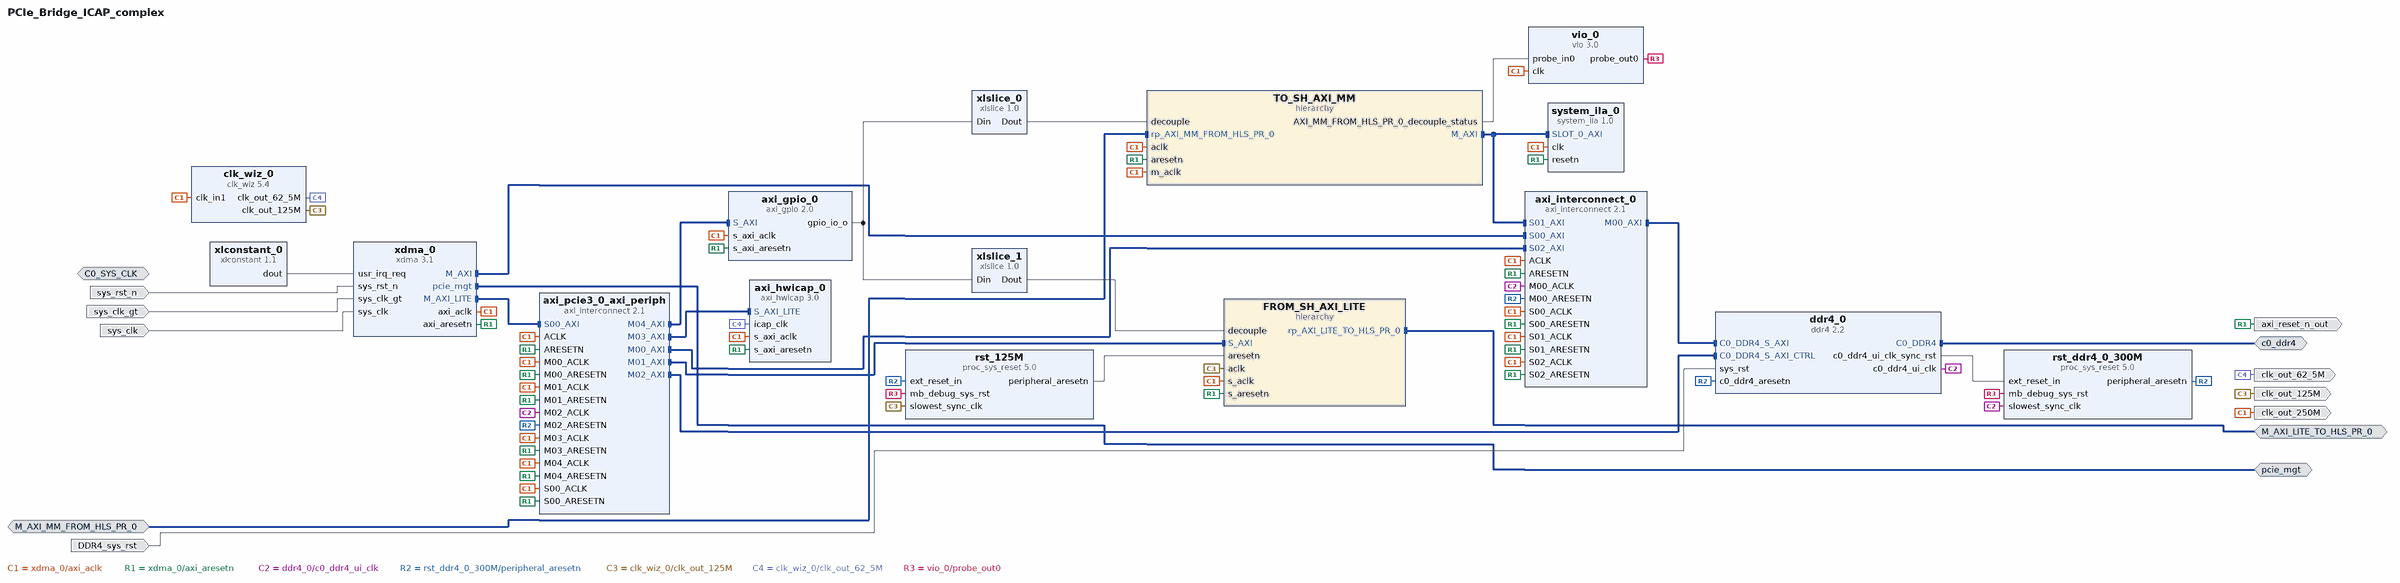
[diagram p0: block diagram of the top level]
# Vivado block design PCIe_Bridge_ICAP_complex, xcku115-flvb2104-2-i, Vivado 2017.1_sdx
create_bd_design PCIe_Bridge_ICAP_complex

create_bd_intf_port -mode Master -vlnv xilinx.com:interface:pcie_7x_mgt_rtl:1.0 pcie_mgt
create_bd_intf_port -mode Master -vlnv xilinx.com:interface:ddr4_rtl:1.0 c0_ddr4
create_bd_intf_port -mode Slave -vlnv xilinx.com:interface:aximm_rtl:1.0 M_AXI_MM_FROM_HLS_PR_0
set_property -dict [list \
  CONFIG.DATA_WIDTH 512 \
  CONFIG.PROTOCOL AXI4 \
  CONFIG.ID_WIDTH 0 \
  CONFIG.ADDR_WIDTH 32 \
  CONFIG.AWUSER_WIDTH 0 \
  CONFIG.ARUSER_WIDTH 0 \
  CONFIG.WUSER_WIDTH 0 \
  CONFIG.RUSER_WIDTH 0 \
  CONFIG.BUSER_WIDTH 0 \
  CONFIG.READ_WRITE_MODE READ_WRITE \
  CONFIG.HAS_BURST 1 \
  CONFIG.HAS_LOCK 1 \
  CONFIG.HAS_PROT 1 \
  CONFIG.HAS_CACHE 1 \
  CONFIG.HAS_QOS 1 \
  CONFIG.HAS_REGION 1 \
  CONFIG.HAS_WSTRB 1 \
  CONFIG.HAS_BRESP 1 \
  CONFIG.HAS_RRESP 1 \
  CONFIG.SUPPORTS_NARROW_BURST 1 \
  CONFIG.NUM_READ_OUTSTANDING 32 \
  CONFIG.NUM_WRITE_OUTSTANDING 32 \
  CONFIG.MAX_BURST_LENGTH 256 \
  CONFIG.NUM_READ_THREADS 1 \
  CONFIG.NUM_WRITE_THREADS 1 \
  CONFIG.RUSER_BITS_PER_BYTE 0 \
  CONFIG.WUSER_BITS_PER_BYTE 0 \
] [get_bd_intf_ports M_AXI_MM_FROM_HLS_PR_0]
create_bd_intf_port -mode Master -vlnv xilinx.com:interface:aximm_rtl:1.0 M_AXI_LITE_TO_HLS_PR_0
set_property -dict [list \
  CONFIG.DATA_WIDTH 32 \
  CONFIG.PROTOCOL AXI4LITE \
  CONFIG.FREQ_HZ 125000000 \
  CONFIG.ADDR_WIDTH 32 \
  CONFIG.HAS_BURST 0 \
  CONFIG.HAS_QOS 0 \
  CONFIG.HAS_REGION 0 \
] [get_bd_intf_ports M_AXI_LITE_TO_HLS_PR_0]
create_bd_intf_port -mode Slave -vlnv xilinx.com:interface:diff_clock_rtl:1.0 C0_SYS_CLK
set_property -dict {CONFIG.FREQ_HZ 300000000} [get_bd_intf_ports C0_SYS_CLK]
create_bd_port -dir O -type clk clk_out_250M
set_property -dict {CONFIG.ASSOCIATED_BUSIF M_AXI_MM_FROM_HLS_PR_0} [get_bd_ports clk_out_250M]
create_bd_port -dir O -type rst axi_reset_n_out
create_bd_port -dir I -type rst DDR4_sys_rst
set_property -dict {CONFIG.POLARITY ACTIVE_HIGH} [get_bd_ports DDR4_sys_rst]
create_bd_port -dir I -type rst sys_rst_n
create_bd_port -dir I -type clk sys_clk_gt
create_bd_port -dir I -type clk sys_clk
create_bd_port -dir O -type clk clk_out_125M
set_property -dict {CONFIG.FREQ_HZ 125000000 CONFIG.ASSOCIATED_BUSIF M_AXI_LITE_TO_HLS_PR_0} [get_bd_ports clk_out_125M]
create_bd_port -dir O -type clk clk_out_62_5M
set_property -dict {CONFIG.FREQ_HZ 62500000} [get_bd_ports clk_out_62_5M]

create_bd_cell -type ip -vlnv xilinx.com:ip:xlconstant:1.1 xlconstant_0
set_property -dict {CONFIG.CONST_VAL 0} [get_bd_cells xlconstant_0]
create_bd_cell -type ip -vlnv xilinx.com:ip:axi_interconnect:2.1 axi_pcie3_0_axi_periph
set_property -dict [list \
  CONFIG.NUM_MI 5 \
  CONFIG.M00_HAS_REGSLICE 4 \
  CONFIG.M01_HAS_REGSLICE 4 \
  CONFIG.M02_HAS_REGSLICE 4 \
  CONFIG.S00_HAS_REGSLICE 4 \
] [get_bd_cells axi_pcie3_0_axi_periph]
create_bd_cell -type ip -vlnv xilinx.com:ip:axi_interconnect:2.1 axi_interconnect_0
set_property -dict [list \
  CONFIG.NUM_SI 3 \
  CONFIG.NUM_MI 1 \
  CONFIG.M00_HAS_REGSLICE 4 \
  CONFIG.M00_HAS_DATA_FIFO 0 \
  CONFIG.S00_HAS_REGSLICE 4 \
  CONFIG.S01_HAS_REGSLICE 4 \
  CONFIG.S02_HAS_REGSLICE 4 \
  CONFIG.S00_HAS_DATA_FIFO 1 \
  CONFIG.S01_HAS_DATA_FIFO 1 \
  CONFIG.S02_HAS_DATA_FIFO 1 \
] [get_bd_cells axi_interconnect_0]
create_bd_cell -type ip -vlnv xilinx.com:ip:ddr4:2.2 ddr4_0
set_property -dict [list \
  CONFIG.C0.DDR4_TimePeriod 1110 \
  CONFIG.C0.DDR4_InputClockPeriod 3330 \
  CONFIG.C0.DDR4_MemoryPart EDY4016AABG-DR-F \
  CONFIG.C0.DDR4_DataWidth 72 \
  CONFIG.C0.DDR4_DataMask NO_DM_NO_DBI \
  CONFIG.C0.DDR4_CasLatency 13 \
  CONFIG.C0.DDR4_CasWriteLatency 12 \
  CONFIG.C0.DDR4_AxiDataWidth 512 \
  CONFIG.C0.DDR4_AxiAddressWidth 31 \
  CONFIG.C0.BANK_GROUP_WIDTH 1 \
] [get_bd_cells ddr4_0]
create_bd_cell -type ip -vlnv xilinx.com:ip:proc_sys_reset:5.0 rst_ddr4_0_300M
create_bd_cell -type ip -vlnv xilinx.com:ip:xdma:3.1 xdma_0
set_property -dict [list \
  CONFIG.mode_selection Advanced \
  CONFIG.pl_link_cap_max_link_width X8 \
  CONFIG.pl_link_cap_max_link_speed 8.0_GT/s \
  CONFIG.axi_data_width 256_bit \
  CONFIG.axisten_freq 250 \
  CONFIG.pipe_sim true \
  CONFIG.pf0_device_id 8038 \
  CONFIG.axilite_master_en true \
  CONFIG.axilite_master_size 512 \
  CONFIG.axilite_master_scale Megabytes \
  CONFIG.cfg_mgmt_if false \
] [get_bd_cells xdma_0]
create_bd_cell -type ip -vlnv xilinx.com:ip:clk_wiz:5.4 clk_wiz_0
set_property -dict [list \
  CONFIG.USE_FREQ_SYNTH true \
  CONFIG.USE_PHASE_ALIGNMENT false \
  CONFIG.JITTER_SEL Min_O_Jitter \
  CONFIG.SECONDARY_SOURCE Single_ended_clock_capable_pin \
  CONFIG.CLKOUT2_USED true \
  CONFIG.NUM_OUT_CLKS 2 \
  CONFIG.CLK_OUT1_PORT clk_out_125M \
  CONFIG.CLK_OUT2_PORT clk_out_62_5M \
  CONFIG.CLKOUT1_REQUESTED_OUT_FREQ 125.000 \
  CONFIG.CLKOUT2_REQUESTED_OUT_FREQ 62.5 \
  CONFIG.PRIM_SOURCE No_buffer \
  CONFIG.CLKOUT1_DRIVES Buffer \
  CONFIG.CLKOUT2_DRIVES Buffer \
  CONFIG.CLKOUT3_DRIVES Buffer \
  CONFIG.CLKOUT4_DRIVES Buffer \
  CONFIG.CLKOUT5_DRIVES Buffer \
  CONFIG.CLKOUT6_DRIVES Buffer \
  CONFIG.CLKOUT7_DRIVES Buffer \
  CONFIG.USE_LOCKED false \
  CONFIG.USE_RESET false \
  CONFIG.MMCM_DIVCLK_DIVIDE 1 \
  CONFIG.MMCM_BANDWIDTH HIGH \
  CONFIG.MMCM_CLKFBOUT_MULT_F 5.750 \
  CONFIG.MMCM_CLKOUT0_DIVIDE_F 11.500 \
  CONFIG.MMCM_CLKOUT1_DIVIDE 23 \
  CONFIG.CLKOUT1_JITTER 92.747 \
  CONFIG.CLKOUT1_PHASE_ERROR 73.217 \
  CONFIG.CLKOUT2_JITTER 106.166 \
  CONFIG.CLKOUT2_PHASE_ERROR 73.217 \
] [get_bd_cells clk_wiz_0]
create_bd_cell -type ip -vlnv xilinx.com:ip:proc_sys_reset:5.0 rst_125M
create_bd_cell -type ip -vlnv xilinx.com:ip:axi_hwicap:3.0 axi_hwicap_0
create_bd_cell -type hier TO_SH_AXI_MM
create_bd_cell -type hier FROM_SH_AXI_LITE
create_bd_cell -type ip -vlnv xilinx.com:ip:axi_gpio:2.0 axi_gpio_0
set_property -dict {CONFIG.C_ALL_OUTPUTS 1} [get_bd_cells axi_gpio_0]
create_bd_cell -type ip -vlnv xilinx.com:ip:xlslice:1.0 xlslice_0
set_property -dict {CONFIG.DIN_TO 0 CONFIG.DIN_FROM 0 CONFIG.DOUT_WIDTH 1} [get_bd_cells xlslice_0]
create_bd_cell -type ip -vlnv xilinx.com:ip:xlslice:1.0 xlslice_1
set_property -dict {CONFIG.DIN_TO 1 CONFIG.DIN_FROM 1 CONFIG.DOUT_WIDTH 1} [get_bd_cells xlslice_1]
create_bd_cell -type ip -vlnv xilinx.com:ip:vio:3.0 vio_0
create_bd_cell -type ip -vlnv xilinx.com:ip:system_ila:1.0 system_ila_0
set_property -dict [list \
  CONFIG.C_SLOT_0_MAX_RD_BURSTS 32 \
  CONFIG.C_SLOT_0_MAX_WR_BURSTS 32 \
  CONFIG.C_SLOT_0_TXN_CNTR_EN 0 \
  CONFIG.C_SLOT_0_AXI_W_SEL_TRIG 0 \
  CONFIG.C_SLOT_0_AXI_B_SEL_TRIG 0 \
  CONFIG.C_SLOT_0_AXI_R_SEL_TRIG 0 \
  CONFIG.C_INPUT_PIPE_STAGES 4 \
  CONFIG.ALL_PROBE_SAME_MU true \
] [get_bd_cells system_ila_0]

# ---- hierarchy /TO_SH_AXI_MM ----
current_bd_instance /TO_SH_AXI_MM
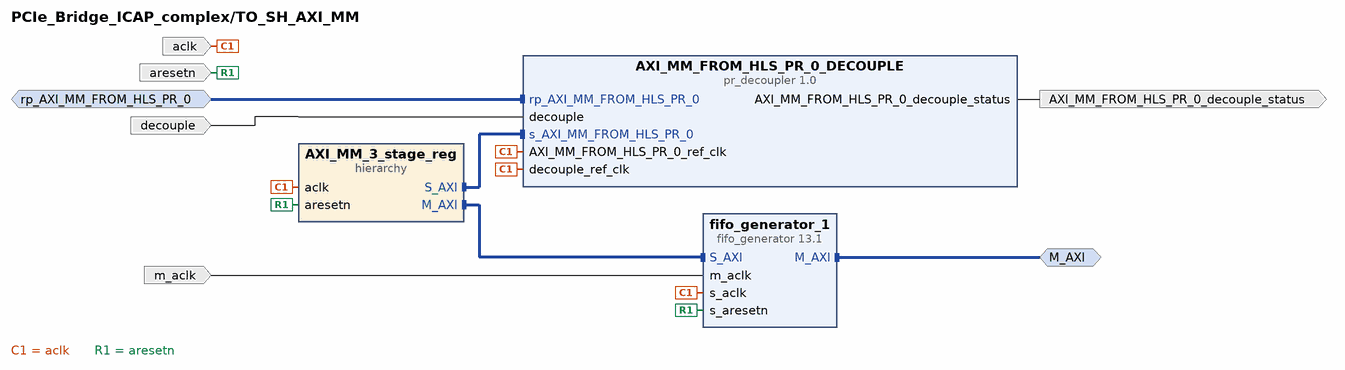
[diagram p1: block diagram inside /TO_SH_AXI_MM]
create_bd_intf_pin -mode Master -vlnv xilinx.com:interface:aximm_rtl:1.0 M_AXI
create_bd_intf_pin -mode Slave -vlnv xilinx.com:interface:aximm_rtl:1.0 rp_AXI_MM_FROM_HLS_PR_0
create_bd_pin -dir I -type clk m_aclk
create_bd_pin -dir I -type clk aclk
create_bd_pin -dir I -type rst aresetn
create_bd_pin -dir I decouple
create_bd_pin -dir O AXI_MM_FROM_HLS_PR_0_decouple_status

create_bd_cell -type ip -vlnv xilinx.com:ip:fifo_generator:13.1 fifo_generator_1
set_property -dict [list \
  CONFIG.INTERFACE_TYPE AXI_MEMORY_MAPPED \
  CONFIG.PROTOCOL AXI4 \
  CONFIG.Clock_Type_AXI Independent_Clock \
  CONFIG.FIFO_Implementation_wach Independent_Clocks_Distributed_RAM \
  CONFIG.FIFO_Implementation_wdch Independent_Clocks_Builtin_FIFO \
  CONFIG.FIFO_Implementation_wrch Independent_Clocks_Distributed_RAM \
  CONFIG.FIFO_Implementation_rach Independent_Clocks_Distributed_RAM \
  CONFIG.FIFO_Implementation_rdch Independent_Clocks_Builtin_FIFO \
  CONFIG.FIFO_Implementation_axis Independent_Clocks_Builtin_FIFO \
] [get_bd_cells fifo_generator_1]
create_bd_cell -type hier AXI_MM_3_stage_reg
create_bd_cell -type ip -vlnv xilinx.com:ip:pr_decoupler:1.0 AXI_MM_FROM_HLS_PR_0_DECOUPLE
set_property -dict [list \
  CONFIG.ALL_PARAMS {HAS_SIGNAL_CONTROL 1 HAS_SIGNAL_STATUS 0 INTF {AXI_MM_FROM_HLS_PR_0 {ID 0 VLNV xilinx.com:interface:aximm_rtl:1.0 CDC_STAGES 4 SIGNALS {ARVALID {PRESENT 1 WIDTH 1} ARREADY {PRESENT 1 WIDTH 1} AWVALID {PRESENT 1 WIDTH 1} AWREADY {PRESENT 1 WIDTH 1} BVALID {PRESENT 1 WIDTH 1} BREADY {PRESENT 1 WIDTH 1} RVALID {PRESENT 1 WIDTH 1} RREADY {PRESENT 1 WIDTH 1} WVALID {PRESENT 1 WIDTH 1} WREADY {PRESENT 1 WIDTH 1} AWID {PRESENT 0 WIDTH 0} AWADDR {PRESENT 1 WIDTH 32} AWLEN {PRESENT 1 WIDTH 8} AWSIZE {PRESENT 1 WIDTH 3} AWBURST {PRESENT 1 WIDTH 2} AWLOCK {PRESENT 1 WIDTH 1} AWCACHE {PRESENT 1 WIDTH 4} AWPROT {PRESENT 1 WIDTH 3} AWREGION {PRESENT 1 WIDTH 4} AWQOS {PRESENT 1 WIDTH 4} AWUSER {PRESENT 0 WIDTH 0} WID {PRESENT 0 WIDTH 0} WDATA {PRESENT 1 WIDTH 512} WSTRB {PRESENT 1 WIDTH 64} WLAST {PRESENT 1 WIDTH 1} WUSER {PRESENT 0 WIDTH 0} BID {PRESENT 0 WIDTH 0} BRESP {PRESENT 1 WIDTH 2} BUSER {PRESENT 0 WIDTH 0} ARID {PRESENT 0 WIDTH 0} ARADDR {PRESENT 1 WIDTH 32} ARLEN {PRESENT 1 WIDTH 8} ARSIZE {PRESENT 1 WIDTH 3} ARBURST {PRESENT 1 WIDTH 2} ARLOCK {PRESENT 1 WIDTH 1} ARCACHE {PRESENT 1 WIDTH 4} ARPROT {PRESENT 1 WIDTH 3} ARREGION {PRESENT 1 WIDTH 4} ARQOS {PRESENT 1 WIDTH 4} ARUSER {PRESENT 0 WIDTH 0} RID {PRESENT 0 WIDTH 0} RDATA {PRESENT 1 WIDTH 512} RRESP {PRESENT 1 WIDTH 2} RLAST {PRESENT 1 WIDTH 1} RUSER {PRESENT 0 WIDTH 0}}}} IPI_PROP_COUNT 0} \
  CONFIG.GUI_HAS_SIGNAL_CONTROL 1 \
  CONFIG.GUI_HAS_SIGNAL_STATUS false \
  CONFIG.GUI_SELECT_INTERFACE 0 \
  CONFIG.GUI_INTERFACE_NAME AXI_MM_FROM_HLS_PR_0 \
  CONFIG.GUI_SELECT_VLNV xilinx.com:interface:aximm_rtl:1.0 \
  CONFIG.GUI_INTERFACE_PROTOCOL axi4 \
  CONFIG.GUI_SELECT_CDC_STAGES 4 \
  CONFIG.GUI_SIGNAL_SELECT_0 ARVALID \
  CONFIG.GUI_SIGNAL_SELECT_1 ARREADY \
  CONFIG.GUI_SIGNAL_SELECT_2 AWVALID \
  CONFIG.GUI_SIGNAL_SELECT_3 AWREADY \
  CONFIG.GUI_SIGNAL_SELECT_4 BVALID \
  CONFIG.GUI_SIGNAL_SELECT_5 BREADY \
  CONFIG.GUI_SIGNAL_SELECT_6 RVALID \
  CONFIG.GUI_SIGNAL_SELECT_7 RREADY \
  CONFIG.GUI_SIGNAL_SELECT_8 WVALID \
  CONFIG.GUI_SIGNAL_SELECT_9 WREADY \
  CONFIG.GUI_SIGNAL_DECOUPLED_0 true \
  CONFIG.GUI_SIGNAL_DECOUPLED_1 true \
  CONFIG.GUI_SIGNAL_DECOUPLED_2 true \
  CONFIG.GUI_SIGNAL_DECOUPLED_3 true \
  CONFIG.GUI_SIGNAL_DECOUPLED_4 true \
  CONFIG.GUI_SIGNAL_DECOUPLED_5 true \
  CONFIG.GUI_SIGNAL_DECOUPLED_6 true \
  CONFIG.GUI_SIGNAL_DECOUPLED_7 true \
  CONFIG.GUI_SIGNAL_DECOUPLED_8 true \
  CONFIG.GUI_SIGNAL_DECOUPLED_9 true \
] [get_bd_cells AXI_MM_FROM_HLS_PR_0_DECOUPLE]

# ---- hierarchy /TO_SH_AXI_MM/AXI_MM_3_stage_reg ----
current_bd_instance /TO_SH_AXI_MM/AXI_MM_3_stage_reg
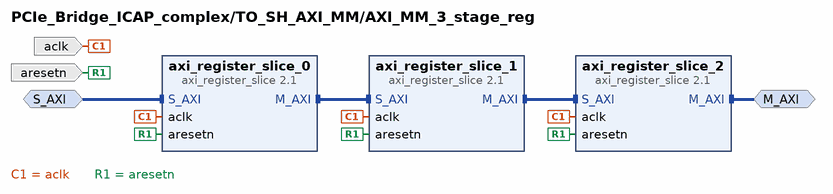
[diagram p2: block diagram inside /TO_SH_AXI_MM/AXI_MM_3_stage_reg]
create_bd_intf_pin -mode Slave -vlnv xilinx.com:interface:aximm_rtl:1.0 S_AXI
create_bd_intf_pin -mode Master -vlnv xilinx.com:interface:aximm_rtl:1.0 M_AXI
create_bd_pin -dir I -type clk aclk
create_bd_pin -dir I -type rst aresetn

create_bd_cell -type ip -vlnv xilinx.com:ip:axi_register_slice:2.1 axi_register_slice_0
create_bd_cell -type ip -vlnv xilinx.com:ip:axi_register_slice:2.1 axi_register_slice_1
create_bd_cell -type ip -vlnv xilinx.com:ip:axi_register_slice:2.1 axi_register_slice_2

# ---- hierarchy /FROM_SH_AXI_LITE ----
current_bd_instance /FROM_SH_AXI_LITE
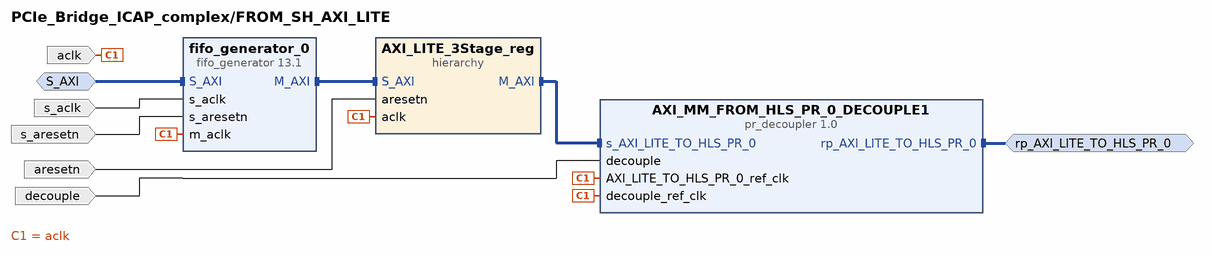
[diagram p3: block diagram inside /FROM_SH_AXI_LITE]
create_bd_intf_pin -mode Slave -vlnv xilinx.com:interface:aximm_rtl:1.0 S_AXI
create_bd_intf_pin -mode Master -vlnv xilinx.com:interface:aximm_rtl:1.0 rp_AXI_LITE_TO_HLS_PR_0
create_bd_pin -dir I -type clk aclk
create_bd_pin -dir I -type clk s_aclk
create_bd_pin -dir I -type rst s_aresetn
create_bd_pin -dir I -type rst aresetn
create_bd_pin -dir I decouple

create_bd_cell -type ip -vlnv xilinx.com:ip:fifo_generator:13.1 fifo_generator_0
set_property -dict [list \
  CONFIG.INTERFACE_TYPE AXI_MEMORY_MAPPED \
  CONFIG.PROTOCOL AXI4_Lite \
  CONFIG.Clock_Type_AXI Independent_Clock \
  CONFIG.FIFO_Implementation_wach Independent_Clocks_Distributed_RAM \
  CONFIG.FIFO_Implementation_wdch Independent_Clocks_Builtin_FIFO \
  CONFIG.FIFO_Implementation_wrch Independent_Clocks_Distributed_RAM \
  CONFIG.FIFO_Implementation_rach Independent_Clocks_Distributed_RAM \
  CONFIG.FIFO_Implementation_rdch Independent_Clocks_Builtin_FIFO \
  CONFIG.FIFO_Implementation_axis Independent_Clocks_Builtin_FIFO \
] [get_bd_cells fifo_generator_0]
create_bd_cell -type hier AXI_LITE_3Stage_reg
create_bd_cell -type ip -vlnv xilinx.com:ip:pr_decoupler:1.0 AXI_MM_FROM_HLS_PR_0_DECOUPLE1
set_property -dict [list \
  CONFIG.ALL_PARAMS {HAS_SIGNAL_CONTROL 1 HAS_SIGNAL_STATUS 0 INTF {AXI_LITE_TO_HLS_PR_0 {ID 0 VLNV xilinx.com:interface:aximm_rtl:1.0 CDC_STAGES 4 MODE slave PROTOCOL axi4lite SIGNALS {ARVALID {PRESENT 1 WIDTH 1} ARREADY {PRESENT 1 WIDTH 1} AWVALID {PRESENT 1 WIDTH 1} AWREADY {PRESENT 1 WIDTH 1} BVALID {PRESENT 1 WIDTH 1} BREADY {PRESENT 1 WIDTH 1} RVALID {PRESENT 1 WIDTH 1} RREADY {PRESENT 1 WIDTH 1} WVALID {PRESENT 1 WIDTH 1} WREADY {PRESENT 1 WIDTH 1} AWADDR {PRESENT 1 WIDTH 32} AWLEN {PRESENT 0 WIDTH 8} AWSIZE {PRESENT 0 WIDTH 3} AWBURST {PRESENT 0 WIDTH 2} AWLOCK {PRESENT 0 WIDTH 1} AWCACHE {PRESENT 0 WIDTH 4} AWPROT {PRESENT 1 WIDTH 3} WDATA {PRESENT 1 WIDTH 32} WSTRB {PRESENT 1 WIDTH 4} WLAST {PRESENT 0 WIDTH 1} BRESP {PRESENT 1 WIDTH 2} ARADDR {PRESENT 1 WIDTH 32} ARLEN {PRESENT 0 WIDTH 8} ARSIZE {PRESENT 0 WIDTH 3} ARBURST {PRESENT 0 WIDTH 2} ARLOCK {PRESENT 0 WIDTH 1} ARCACHE {PRESENT 0 WIDTH 4} ARPROT {PRESENT 1 WIDTH 3} RDATA {PRESENT 1 WIDTH 32} RRESP {PRESENT 1 WIDTH 2} RLAST {PRESENT 0 WIDTH 1} AWID {PRESENT 0 WIDTH 0} AWREGION {PRESENT 1 WIDTH 4} AWQOS {PRESENT 1 WIDTH 4} AWUSER {PRESENT 0 WIDTH 0} WID {PRESENT 0 WIDTH 0} WUSER {PRESENT 0 WIDTH 0} BID {PRESENT 0 WIDTH 0} BUSER {PRESENT 0 WIDTH 0} ARID {PRESENT 0 WIDTH 0} ARREGION {PRESENT 1 WIDTH 4} ARQOS {PRESENT 1 WIDTH 4} ARUSER {PRESENT 0 WIDTH 0} RID {PRESENT 0 WIDTH 0} RUSER {PRESENT 0 WIDTH 0}}}} IPI_PROP_COUNT 1} \
  CONFIG.GUI_HAS_SIGNAL_CONTROL 1 \
  CONFIG.GUI_HAS_SIGNAL_STATUS 0 \
  CONFIG.GUI_SELECT_INTERFACE 0 \
  CONFIG.GUI_INTERFACE_NAME AXI_LITE_TO_HLS_PR_0 \
  CONFIG.GUI_SELECT_VLNV xilinx.com:interface:aximm_rtl:1.0 \
  CONFIG.GUI_INTERFACE_PROTOCOL axi4lite \
  CONFIG.GUI_SELECT_MODE slave \
  CONFIG.GUI_SELECT_CDC_STAGES 4 \
  CONFIG.GUI_SIGNAL_SELECT_0 ARVALID \
  CONFIG.GUI_SIGNAL_SELECT_1 ARREADY \
  CONFIG.GUI_SIGNAL_SELECT_2 AWVALID \
  CONFIG.GUI_SIGNAL_SELECT_3 AWREADY \
  CONFIG.GUI_SIGNAL_SELECT_4 BVALID \
  CONFIG.GUI_SIGNAL_SELECT_5 BREADY \
  CONFIG.GUI_SIGNAL_SELECT_6 RVALID \
  CONFIG.GUI_SIGNAL_SELECT_7 RREADY \
  CONFIG.GUI_SIGNAL_SELECT_8 WVALID \
  CONFIG.GUI_SIGNAL_SELECT_9 WREADY \
  CONFIG.GUI_SIGNAL_DECOUPLED_0 true \
  CONFIG.GUI_SIGNAL_DECOUPLED_1 true \
  CONFIG.GUI_SIGNAL_DECOUPLED_2 true \
  CONFIG.GUI_SIGNAL_DECOUPLED_3 true \
  CONFIG.GUI_SIGNAL_DECOUPLED_4 true \
  CONFIG.GUI_SIGNAL_DECOUPLED_5 true \
  CONFIG.GUI_SIGNAL_DECOUPLED_6 true \
  CONFIG.GUI_SIGNAL_DECOUPLED_7 true \
  CONFIG.GUI_SIGNAL_DECOUPLED_8 true \
  CONFIG.GUI_SIGNAL_DECOUPLED_9 true \
] [get_bd_cells AXI_MM_FROM_HLS_PR_0_DECOUPLE1]

# ---- hierarchy /FROM_SH_AXI_LITE/AXI_LITE_3Stage_reg ----
current_bd_instance /FROM_SH_AXI_LITE/AXI_LITE_3Stage_reg
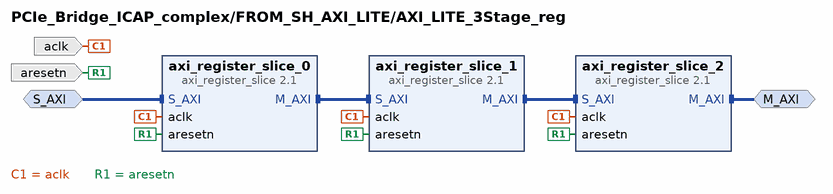
[diagram p4: block diagram inside /FROM_SH_AXI_LITE/AXI_LITE_3Stage_reg]
create_bd_intf_pin -mode Slave -vlnv xilinx.com:interface:aximm_rtl:1.0 S_AXI
create_bd_intf_pin -mode Master -vlnv xilinx.com:interface:aximm_rtl:1.0 M_AXI
create_bd_pin -dir I -type clk aclk
create_bd_pin -dir I -type rst aresetn

create_bd_cell -type ip -vlnv xilinx.com:ip:axi_register_slice:2.1 axi_register_slice_0
create_bd_cell -type ip -vlnv xilinx.com:ip:axi_register_slice:2.1 axi_register_slice_1
create_bd_cell -type ip -vlnv xilinx.com:ip:axi_register_slice:2.1 axi_register_slice_2

# ---- connections ----

current_bd_instance /TO_SH_AXI_MM
connect_bd_intf_net [get_bd_intf_pins AXI_MM_3_stage_reg/M_AXI] [get_bd_intf_pins fifo_generator_1/S_AXI]
connect_bd_intf_net [get_bd_intf_pins AXI_MM_3_stage_reg/S_AXI] [get_bd_intf_pins AXI_MM_FROM_HLS_PR_0_DECOUPLE/s_AXI_MM_FROM_HLS_PR_0]
connect_bd_intf_net [get_bd_intf_pins M_AXI] [get_bd_intf_pins fifo_generator_1/M_AXI]
connect_bd_intf_net [get_bd_intf_pins rp_AXI_MM_FROM_HLS_PR_0] [get_bd_intf_pins AXI_MM_FROM_HLS_PR_0_DECOUPLE/rp_AXI_MM_FROM_HLS_PR_0]
connect_bd_net -net axi_pcie3_0_axi_aclk [get_bd_pins m_aclk] [get_bd_pins fifo_generator_1/m_aclk]
connect_bd_net -net clk_wiz_0_clk_out_125M [get_bd_pins aclk] \
  [get_bd_pins fifo_generator_1/s_aclk] [get_bd_pins AXI_MM_FROM_HLS_PR_0_DECOUPLE/decouple_ref_clk] \
  [get_bd_pins AXI_MM_FROM_HLS_PR_0_DECOUPLE/AXI_MM_FROM_HLS_PR_0_ref_clk] [get_bd_pins AXI_MM_3_stage_reg/aclk]
connect_bd_net -net rst_ddr4_0_300M1_peripheral_aresetn [get_bd_pins aresetn] \
  [get_bd_pins fifo_generator_1/s_aresetn] [get_bd_pins AXI_MM_3_stage_reg/aresetn]
connect_bd_net [get_bd_pins decouple] [get_bd_pins AXI_MM_FROM_HLS_PR_0_DECOUPLE/decouple]
connect_bd_net [get_bd_pins AXI_MM_FROM_HLS_PR_0_DECOUPLE/AXI_MM_FROM_HLS_PR_0_decouple_status] [get_bd_pins AXI_MM_FROM_HLS_PR_0_decouple_status]

current_bd_instance /TO_SH_AXI_MM/AXI_MM_3_stage_reg
connect_bd_intf_net [get_bd_intf_pins axi_register_slice_1/S_AXI] [get_bd_intf_pins axi_register_slice_0/M_AXI]
connect_bd_intf_net [get_bd_intf_pins axi_register_slice_2/S_AXI] [get_bd_intf_pins axi_register_slice_1/M_AXI]
connect_bd_intf_net [get_bd_intf_pins S_AXI] [get_bd_intf_pins axi_register_slice_0/S_AXI]
connect_bd_intf_net [get_bd_intf_pins M_AXI] [get_bd_intf_pins axi_register_slice_2/M_AXI]
connect_bd_net -net axi_pcie3_0_axi_aclk [get_bd_pins aclk] \
  [get_bd_pins axi_register_slice_2/aclk] [get_bd_pins axi_register_slice_1/aclk] [get_bd_pins axi_register_slice_0/aclk]
connect_bd_net -net axi_pcie3_0_axi_aresetn [get_bd_pins aresetn] \
  [get_bd_pins axi_register_slice_2/aresetn] [get_bd_pins axi_register_slice_1/aresetn] \
  [get_bd_pins axi_register_slice_0/aresetn]

current_bd_instance /FROM_SH_AXI_LITE
connect_bd_intf_net [get_bd_intf_pins fifo_generator_0/M_AXI] [get_bd_intf_pins AXI_LITE_3Stage_reg/S_AXI]
connect_bd_intf_net [get_bd_intf_pins AXI_LITE_3Stage_reg/M_AXI] [get_bd_intf_pins AXI_MM_FROM_HLS_PR_0_DECOUPLE1/s_AXI_LITE_TO_HLS_PR_0]
connect_bd_intf_net [get_bd_intf_pins S_AXI] [get_bd_intf_pins fifo_generator_0/S_AXI]
connect_bd_intf_net [get_bd_intf_pins rp_AXI_LITE_TO_HLS_PR_0] [get_bd_intf_pins AXI_MM_FROM_HLS_PR_0_DECOUPLE1/rp_AXI_LITE_TO_HLS_PR_0]
connect_bd_net -net clk_wiz_0_clk_out_125M [get_bd_pins aclk] \
  [get_bd_pins fifo_generator_0/m_aclk] [get_bd_pins AXI_MM_FROM_HLS_PR_0_DECOUPLE1/AXI_LITE_TO_HLS_PR_0_ref_clk] \
  [get_bd_pins AXI_MM_FROM_HLS_PR_0_DECOUPLE1/decouple_ref_clk] [get_bd_pins AXI_LITE_3Stage_reg/aclk]
connect_bd_net -net axi_pcie3_0_axi_aclk [get_bd_pins s_aclk] [get_bd_pins fifo_generator_0/s_aclk]
connect_bd_net -net axi_pcie3_0_axi_aresetn [get_bd_pins s_aresetn] [get_bd_pins fifo_generator_0/s_aresetn]
connect_bd_net -net rst_ddr4_0_300M1_peripheral_aresetn [get_bd_pins aresetn] [get_bd_pins AXI_LITE_3Stage_reg/aresetn]
connect_bd_net [get_bd_pins decouple] [get_bd_pins AXI_MM_FROM_HLS_PR_0_DECOUPLE1/decouple]

current_bd_instance /FROM_SH_AXI_LITE/AXI_LITE_3Stage_reg
connect_bd_intf_net [get_bd_intf_pins axi_register_slice_1/M_AXI] [get_bd_intf_pins axi_register_slice_2/S_AXI]
connect_bd_intf_net [get_bd_intf_pins axi_register_slice_1/S_AXI] [get_bd_intf_pins axi_register_slice_0/M_AXI]
connect_bd_intf_net [get_bd_intf_pins S_AXI] [get_bd_intf_pins axi_register_slice_0/S_AXI]
connect_bd_intf_net [get_bd_intf_pins M_AXI] [get_bd_intf_pins axi_register_slice_2/M_AXI]
connect_bd_net [get_bd_pins aclk] \
  [get_bd_pins axi_register_slice_0/aclk] [get_bd_pins axi_register_slice_1/aclk] [get_bd_pins axi_register_slice_2/aclk]
connect_bd_net [get_bd_pins aresetn] \
  [get_bd_pins axi_register_slice_0/aresetn] [get_bd_pins axi_register_slice_1/aresetn] \
  [get_bd_pins axi_register_slice_2/aresetn]

current_bd_instance /
connect_bd_intf_net [get_bd_intf_pins axi_pcie3_0_axi_periph/M02_AXI] [get_bd_intf_pins ddr4_0/C0_DDR4_S_AXI_CTRL]
connect_bd_intf_net [get_bd_intf_pins axi_pcie3_0_axi_periph/S00_AXI] [get_bd_intf_pins xdma_0/M_AXI_LITE]
connect_bd_intf_net [get_bd_intf_pins axi_interconnect_0/M00_AXI] [get_bd_intf_pins ddr4_0/C0_DDR4_S_AXI]
connect_bd_intf_net [get_bd_intf_pins axi_interconnect_0/S00_AXI] [get_bd_intf_pins xdma_0/M_AXI]
connect_bd_intf_net [get_bd_intf_pins axi_interconnect_0/S02_AXI] [get_bd_intf_pins axi_pcie3_0_axi_periph/M00_AXI]
connect_bd_intf_net [get_bd_intf_pins FROM_SH_AXI_LITE/S_AXI] [get_bd_intf_pins axi_pcie3_0_axi_periph/M01_AXI]
connect_bd_intf_net [get_bd_intf_pins TO_SH_AXI_MM/M_AXI] [get_bd_intf_pins axi_interconnect_0/S01_AXI]
connect_bd_intf_net [get_bd_intf_pins TO_SH_AXI_MM/M_AXI] [get_bd_intf_pins system_ila_0/SLOT_0_AXI]
connect_bd_intf_net [get_bd_intf_pins axi_hwicap_0/S_AXI_LITE] [get_bd_intf_pins axi_pcie3_0_axi_periph/M03_AXI]
connect_bd_intf_net [get_bd_intf_pins axi_gpio_0/S_AXI] [get_bd_intf_pins axi_pcie3_0_axi_periph/M04_AXI]
connect_bd_intf_net [get_bd_intf_ports pcie_mgt] [get_bd_intf_pins xdma_0/pcie_mgt]
connect_bd_intf_net [get_bd_intf_ports c0_ddr4] [get_bd_intf_pins ddr4_0/C0_DDR4]
connect_bd_intf_net [get_bd_intf_ports M_AXI_MM_FROM_HLS_PR_0] [get_bd_intf_pins TO_SH_AXI_MM/rp_AXI_MM_FROM_HLS_PR_0]
connect_bd_intf_net [get_bd_intf_ports M_AXI_LITE_TO_HLS_PR_0] [get_bd_intf_pins FROM_SH_AXI_LITE/rp_AXI_LITE_TO_HLS_PR_0]
connect_bd_net -net axi_pcie3_0_axi_aclk [get_bd_pins xdma_0/axi_aclk] \
  [get_bd_ports clk_out_250M] [get_bd_pins clk_wiz_0/clk_in1] [get_bd_pins axi_hwicap_0/s_axi_aclk] \
  [get_bd_pins axi_gpio_0/s_axi_aclk] [get_bd_pins vio_0/clk] [get_bd_pins system_ila_0/clk] \
  [get_bd_pins axi_pcie3_0_axi_periph/S00_ACLK] [get_bd_pins axi_pcie3_0_axi_periph/M00_ACLK] \
  [get_bd_pins axi_pcie3_0_axi_periph/ACLK] [get_bd_pins axi_interconnect_0/ACLK] [get_bd_pins axi_interconnect_0/S00_ACLK] \
  [get_bd_pins axi_interconnect_0/S02_ACLK] [get_bd_pins axi_pcie3_0_axi_periph/M01_ACLK] \
  [get_bd_pins axi_interconnect_0/S01_ACLK] [get_bd_pins axi_pcie3_0_axi_periph/M03_ACLK] [get_bd_pins TO_SH_AXI_MM/m_aclk] \
  [get_bd_pins FROM_SH_AXI_LITE/s_aclk] [get_bd_pins axi_pcie3_0_axi_periph/M04_ACLK] [get_bd_pins TO_SH_AXI_MM/aclk]
connect_bd_net -net axi_pcie3_0_axi_aresetn [get_bd_pins xdma_0/axi_aresetn] \
  [get_bd_ports axi_reset_n_out] [get_bd_pins axi_hwicap_0/s_axi_aresetn] [get_bd_pins axi_gpio_0/s_axi_aresetn] \
  [get_bd_pins system_ila_0/resetn] [get_bd_pins axi_pcie3_0_axi_periph/S00_ARESETN] \
  [get_bd_pins axi_pcie3_0_axi_periph/M00_ARESETN] [get_bd_pins axi_pcie3_0_axi_periph/ARESETN] \
  [get_bd_pins axi_interconnect_0/ARESETN] [get_bd_pins axi_interconnect_0/S00_ARESETN] \
  [get_bd_pins axi_interconnect_0/S02_ARESETN] [get_bd_pins axi_pcie3_0_axi_periph/M01_ARESETN] \
  [get_bd_pins axi_interconnect_0/S01_ARESETN] [get_bd_pins axi_pcie3_0_axi_periph/M03_ARESETN] \
  [get_bd_pins FROM_SH_AXI_LITE/s_aresetn] [get_bd_pins axi_pcie3_0_axi_periph/M04_ARESETN] \
  [get_bd_pins TO_SH_AXI_MM/aresetn]
connect_bd_net [get_bd_pins ddr4_0/c0_ddr4_ui_clk] \
  [get_bd_pins rst_ddr4_0_300M/slowest_sync_clk] [get_bd_pins axi_pcie3_0_axi_periph/M02_ACLK] \
  [get_bd_pins axi_interconnect_0/M00_ACLK]
connect_bd_net [get_bd_pins ddr4_0/c0_ddr4_ui_clk_sync_rst] [get_bd_pins rst_ddr4_0_300M/ext_reset_in]
connect_bd_net [get_bd_pins rst_ddr4_0_300M/peripheral_aresetn] \
  [get_bd_pins ddr4_0/c0_ddr4_aresetn] [get_bd_pins rst_125M/ext_reset_in] [get_bd_pins axi_pcie3_0_axi_periph/M02_ARESETN] \
  [get_bd_pins axi_interconnect_0/M00_ARESETN]
connect_bd_net -net sys_rst_1 [get_bd_ports DDR4_sys_rst] [get_bd_pins ddr4_0/sys_rst]
connect_bd_net [get_bd_pins xlconstant_0/dout] [get_bd_pins xdma_0/usr_irq_req]
connect_bd_net [get_bd_ports sys_rst_n] [get_bd_pins xdma_0/sys_rst_n]
connect_bd_net [get_bd_ports sys_clk_gt] [get_bd_pins xdma_0/sys_clk_gt]
connect_bd_net [get_bd_ports sys_clk] [get_bd_pins xdma_0/sys_clk]
connect_bd_net [get_bd_pins clk_wiz_0/clk_out_125M] \
  [get_bd_ports clk_out_125M] [get_bd_pins rst_125M/slowest_sync_clk] [get_bd_pins FROM_SH_AXI_LITE/aclk]
connect_bd_net [get_bd_pins clk_wiz_0/clk_out_62_5M] [get_bd_ports clk_out_62_5M] [get_bd_pins axi_hwicap_0/icap_clk]
connect_bd_net -net rst_ddr4_0_300M1_peripheral_aresetn [get_bd_pins rst_125M/peripheral_aresetn] [get_bd_pins FROM_SH_AXI_LITE/aresetn]
connect_bd_net [get_bd_pins axi_gpio_0/gpio_io_o] [get_bd_pins xlslice_0/Din] [get_bd_pins xlslice_1/Din]
connect_bd_net [get_bd_pins xlslice_0/Dout] [get_bd_pins TO_SH_AXI_MM/decouple]
connect_bd_net [get_bd_pins xlslice_1/Dout] [get_bd_pins FROM_SH_AXI_LITE/decouple]
connect_bd_net [get_bd_pins vio_0/probe_out0] [get_bd_pins rst_ddr4_0_300M/mb_debug_sys_rst] [get_bd_pins rst_125M/mb_debug_sys_rst]
connect_bd_net [get_bd_pins TO_SH_AXI_MM/AXI_MM_FROM_HLS_PR_0_decouple_status] [get_bd_pins vio_0/probe_in0]

# ---- address map ----
assign_bd_address -offset 0x00000000 -range 2G -target_address_space [get_bd_addr_spaces M_AXI_MM_FROM_HLS_PR_0] [get_bd_addr_segs ddr4_0/C0_DDR4_MEMORY_MAP/C0_DDR4_ADDRESS_BLOCK]
assign_bd_address -offset 0x0000000000000000 -range 2G -target_address_space [get_bd_addr_spaces xdma_0/M_AXI] [get_bd_addr_segs ddr4_0/C0_DDR4_MEMORY_MAP/C0_DDR4_ADDRESS_BLOCK]
assign_bd_address -offset 0x00000000 -range 256M -target_address_space [get_bd_addr_spaces xdma_0/M_AXI_LITE] [get_bd_addr_segs ddr4_0/C0_DDR4_MEMORY_MAP/C0_DDR4_ADDRESS_BLOCK]
assign_bd_address -offset 0x10000000 -range 64K -target_address_space [get_bd_addr_spaces xdma_0/M_AXI_LITE] [get_bd_addr_segs axi_hwicap_0/S_AXI_LITE/Reg]
assign_bd_address -offset 0x10010000 -range 64K -target_address_space [get_bd_addr_spaces xdma_0/M_AXI_LITE] [get_bd_addr_segs M_AXI_LITE_TO_HLS_PR_0/Reg]
assign_bd_address -offset 0x10020000 -range 64K -target_address_space [get_bd_addr_spaces xdma_0/M_AXI_LITE] [get_bd_addr_segs ddr4_0/C0_DDR4_MEMORY_MAP_CTRL/C0_REG]
assign_bd_address -offset 0x10030000 -range 64K -target_address_space [get_bd_addr_spaces xdma_0/M_AXI_LITE] [get_bd_addr_segs axi_gpio_0/S_AXI/Reg]

validate_bd_design
save_bd_design
